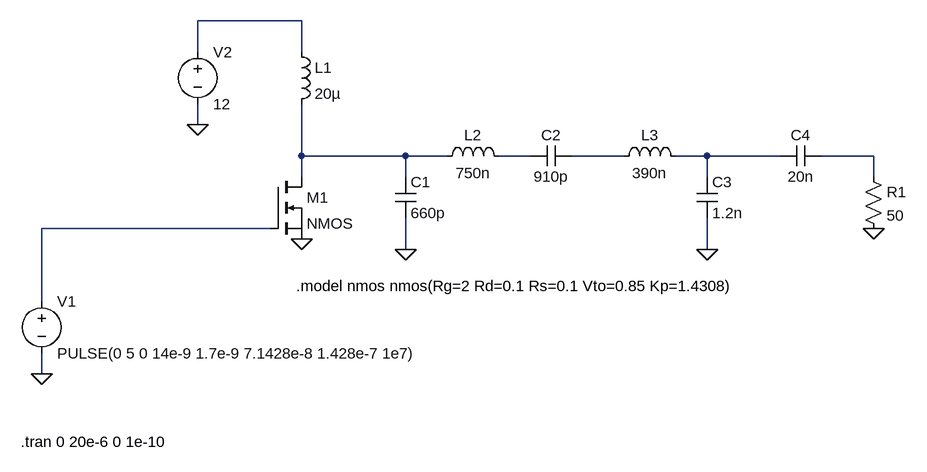
[diagram p0: schematic class_e_amp_7MHz.asc]
class_e_amp_7MHz.asc, the LTspice schematic file:
Version 4
SHEET 1 1176 680
WIRE 240 -96 80 -96
WIRE 80 -48 80 -96
WIRE 240 -48 240 -96
WIRE 80 64 80 32
WIRE 240 112 240 32
WIRE 400 112 240 112
WIRE 464 112 400 112
WIRE 592 112 544 112
WIRE 736 112 656 112
WIRE 864 112 816 112
WIRE 976 112 864 112
WIRE 1120 112 1040 112
WIRE 240 144 240 112
WIRE 400 144 400 112
WIRE 864 144 864 112
WIRE 1120 144 1120 112
WIRE 192 224 -160 224
WIRE 400 256 400 208
WIRE 864 256 864 208
WIRE -160 336 -160 224
WIRE -160 448 -160 416
FLAG 240 240 0
FLAG -160 448 0
FLAG 80 64 0
FLAG 400 256 0
FLAG 864 256 0
FLAG 1120 224 0
SYMBOL nmos 192 144 R0
SYMATTR InstName M1
SYMBOL voltage -160 320 R0
WINDOW 123 0 0 Left 0
WINDOW 39 0 0 Left 0
SYMATTR InstName V1
SYMATTR Value PULSE(0 5 0 14e-9 1.7e-9 7.1428e-8 1.428e-7 1e7)
SYMBOL ind 224 -64 R0
SYMATTR InstName L1
SYMATTR Value 20µ
SYMATTR SpiceLine Ipk=2 Rser=1
SYMBOL voltage 80 -64 R0
WINDOW 123 0 0 Left 0
WINDOW 39 0 0 Left 0
SYMATTR InstName V2
SYMATTR Value 12
SYMBOL cap 384 144 R0
SYMATTR InstName C1
SYMATTR Value 660p
SYMBOL cap 656 96 R90
WINDOW 0 0 32 VBottom 2
WINDOW 3 32 32 VTop 2
SYMATTR InstName C2
SYMATTR Value 910p
SYMBOL ind 448 128 R270
WINDOW 0 32 56 VTop 2
WINDOW 3 5 56 VBottom 2
SYMATTR InstName L2
SYMATTR Value 750n
SYMBOL ind 720 128 R270
WINDOW 0 32 56 VTop 2
WINDOW 3 5 56 VBottom 2
SYMATTR InstName L3
SYMATTR Value 390n
SYMBOL cap 848 144 R0
SYMATTR InstName C3
SYMATTR Value 1.2n
SYMBOL res 1104 128 R0
SYMATTR InstName R1
SYMATTR Value 50
SYMBOL cap 1040 96 R90
WINDOW 0 0 32 VBottom 2
WINDOW 3 32 32 VTop 2
SYMATTR InstName C4
SYMATTR Value 20n
TEXT 232 312 Left 2 !.model nmos nmos(Rg=2 Rd=0.1 Rs=0.1 Vto=0.85 Kp=1.4308)
TEXT -192 552 Left 2 !.tran 0 20e-6 0 1e-10

The netlist it stands for:
* class_e_amp_7MHz.asc
M1 N002 N007 0 0 NMOS
V1 N007 0 PULSE(0 5 0 14e-9 1.7e-9 7.1428e-8 1.428e-7 1e7)
L1 N001 N002 20µ Ipk=2 Rser=1
V2 N001 0 12
C1 N002 0 660p
C2 N004 N003 910p
L2 N002 N003 750n
L3 N004 N005 390n
C3 N005 0 1.2n
R1 N006 0 50
C4 N006 N005 20n
.model NMOS NMOS
.model PMOS PMOS
.lib standard.mos
.model nmos nmos(Rg=2 Rd=0.1 Rs=0.1 Vto=0.85 Kp=1.4308)
.tran 0 20e-6 0 1e-10
.backanno
.end